# EAGLE design usb2ax_v2 (EAGLE 5.10)
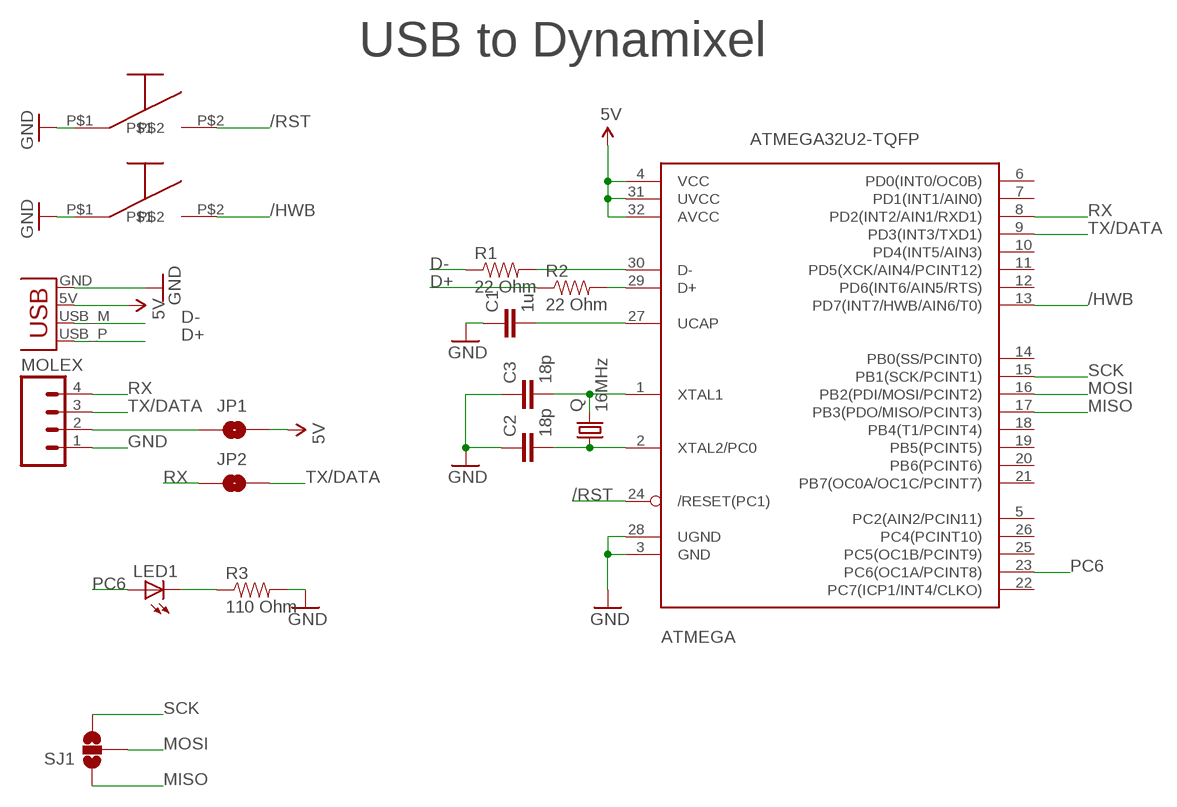
[diagram p0: schematic, sheet 1]

## Parts
ATMEGA  ATMEGA32U2-TQFP  [TQFP32-08]
C1  1u  CAP0603-CAP  [0603-CAP]
C2  18p  CAP0603-CAP  [0603-CAP]
C3  18p  CAP0603-CAP  [0603-CAP]
HWB  B3U-3000P  [B3U3000P]
JP1  SOLDERJUMPERNO  [SJ_2S-NO]
JP2  SOLDERJUMPERNO  [SJ_2S-NO]
LED1  LED0603  [LED-0603]
MOLEX  M041X04_NO_SILK  [1X04_NO_SILK]
Q  16MHz  CRYSTALHC49US  [HC49US]
R1  22 Ohm  RESISTOR0603-RES  [0603-RES]
R2  22 Ohm  RESISTOR0603-RES  [0603-RES]
R3  110 Ohm  RESISTOR0603-RES  [0603-RES]
RST  B3U-3000P  [B3U3000P]
SJ1  SOLDERJUMPER_2WAYS  [SJ_3]
X1  USBPCB  [USB-A-PCB]

## Nets
5V: ATMEGA.4(VCC) ATMEGA.31(UVCC) ATMEGA.32(AVCC) JP1.2 X1.5V(VBUS)
/HWB: ATMEGA.13(PD7(INT7/HWB/AIN6/T0)) HWB.P$2
/RST: ATMEGA.24(/RESET(PC1)) RST.P$2
D+: R2.1 X1.USB_P(D+)
D-: R1.1 X1.USB_M(D-)
GND: ATMEGA.3(GND) ATMEGA.28(UGND) C1.1 C2.1 C3.1 HWB.P$1 MOLEX.1 R3.2 RST.P$1 X1.GND
MISO: ATMEGA.17(PB3(PDO/MISO/PCINT3)) SJ1.1
MOSI: ATMEGA.16(PB2(PDI/MOSI/PCINT2)) SJ1.2
N$2: JP1.1 MOLEX.2
N$7: ATMEGA.2(XTAL2/PC0) C2.2 Q.1
N$8: ATMEGA.1(XTAL1) C3.2 Q.2
N$9: ATMEGA.29(D+) R2.2
N$10: ATMEGA.30(D-) R1.2
N$11: ATMEGA.27(UCAP) C1.2
N$12: LED1.C R3.1
PC6: ATMEGA.23(PC6(OC1A/PCINT8)) LED1.A
RX: ATMEGA.8(PD2(INT2/AIN1/RXD1)) JP2.1 MOLEX.4
SCK: ATMEGA.15(PB1(SCK/PCINT1)) SJ1.3
TX/DATA: ATMEGA.9(PD3(INT3/TXD1)) JP2.2 MOLEX.3
Unconnected: ATMEGA.5(PC2(AIN2/PCIN11)) ATMEGA.6(PD0(INT0/OC0B)) ATMEGA.7(PD1(INT1/AIN0)) ATMEGA.10(PD4(INT5/AIN3)) ATMEGA.11(PD5(XCK/AIN4/PCINT12)) ATMEGA.12(PD6(INT6/AIN5/RTS)) ATMEGA.14(PB0(SS/PCINT0)) ATMEGA.18(PB4(T1/PCINT4)) ATMEGA.19(PB5(PCINT5)) ATMEGA.20(PB6(PCINT6)) ATMEGA.21(PB7(OC0A/OC1C/PCINT7)) ATMEGA.22(PC7(ICP1/INT4/CLKO)) ATMEGA.25(PC5(OC1B/PCINT9)) ATMEGA.26(PC4(PCINT10))

## Notes on the sheet
- USB to Dynamixel

## Library data of the parts
ATMEGA = adafruit:ATMEGA32U2: ATmega32u2 Pin compatible with the atmega8u2, atmega16u2 and atmega32u2 8, 16 or 32 K flash, 1K RAM, 512b EEPROM 8 bit and 16 bit timer (5 PWM total) UART, SPI (no I2C!) USB with 4 endpoints, LUFA compatible 22 I/O lines, analog comparator (no ADC!) Comes with DFU bootloader burned in!
C1-C3 = SparkFun:CAP: Capacitor Standard 0603 ceramic capacitor, and 0.1" leaded capacitor.
HWB RST = omron-switch:B3U-3000P
JP1 JP2 = SparkFun:SOLDERJUMPER: Solder Jumper Standard SMD solder jumper. Used to automate production. Two varients : Normally Open and Normally Closed are the same, but have different paste layers. NC will have a large amount of paste and should jumper during reflow.
LED1 = SparkFun:LED: LEDs Standard schematic elements and footprints for 5mm, 3mm, 1206, and 0603 sized LEDs. 5mm - Spark Fun Electronics SKU : COM-00529 (and others)
MOLEX = SparkFun:M04: Header 4 Standard 4-pin 0.1" header. Use with straight break away headers (SKU : PRT-00116), right angle break away headers (PRT-00553), swiss pins (PRT-00743), machine pins (PRT-00117), and female headers (PRT-00115). Molex polarized connector foot print use with SKU : PRT-08231 with associated crimp pins and housings.
Q = SparkFun:CRYSTAL: Crystals Various standard crystals. Proven footprints. Spark Fun Electronics SKU : COM-00534
R1-R3 = SparkFun:RESISTOR: Resistor Basic schematic elements and footprints for 0603, 1206, and PTH 1/10th watt (small) resistors.
SJ1 = SparkFun:SOLDERJUMPER_2WAY: Solder Jumper 2 way solder jumper
X1 = SparkFun:USB: USB Connectors USB-B-PTH is fully proven SKU : PRT-00139 USB-miniB is fully proven SKU : PRT-00587 USB-A-PCB is untested. USB-A-H is throughly reviewed, but untested. Spark Fun Electronics SKU : PRT-00437 USB-B-SMT is throughly reviewed, but untested. Needs silkscreen touching up. USB-A-S has not been used/tested USB-MB-H has not been used/tested

## Board
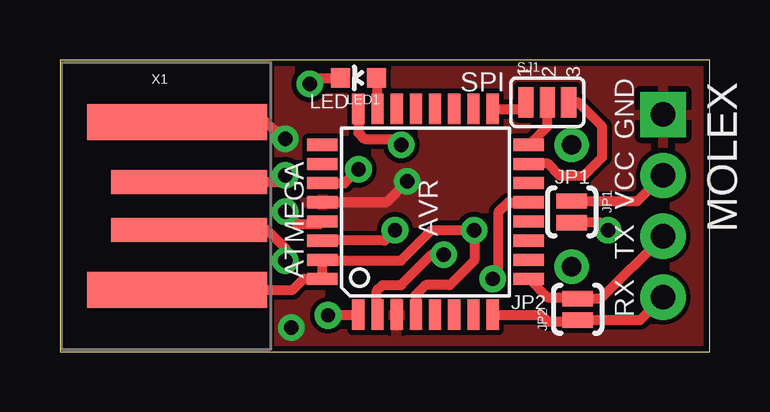
[diagram p1: board, top side]
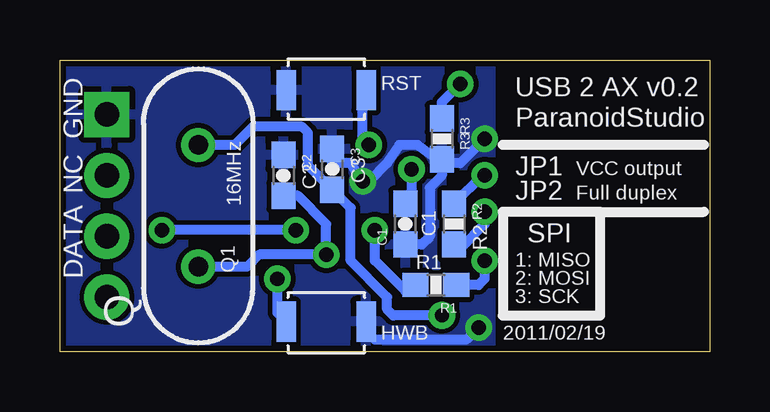
[diagram p2: board, bottom side, seen from below]

Size 27.1 x 12.18 mm. Coordinates in mm from the lower left corner, seen from the top.
Outline: 0,0 27.1,0 27.1,12.18 0,12.18 0,0
Copper layers (1*16): Top 0.035mm / dielectric 1.5mm / Bottom 0.035mm
Design rules "SparkFun": minimum track width 8mil, minimum drill 20mil, track to track 8mil, track to pad 8mil, pad to pad 8mil, via to via 8mil, smd to smd 8mil, copper to edge 10mil, drill to drill 8mil, minimum pad ring 12mil, minimum via ring 10mil, stop-mask expansion 4mil, vias tented up to drill 25mil, thermal gap 10mil

### Footprints (pad centres in the part's own frame; a part is rotated, then mirrored left to right if it is on the bottom)
TQFP32-08 = smd 1.27 x 0.508: 1 -4.293,2.8; 2 -4.293,2; 3 -4.293,1.2; 4 -4.293,0.4; 5 -4.293,-0.4; 6 -4.293,-1.2; 7 -4.293,-2; 8 -4.293,-2.8; 17 4.293,-2.8; 18 4.293,-2; 19 4.293,-1.2; 20 4.293,-0.4; 21 4.293,0.4; 22 4.293,1.2; 23 4.293,2; 24 4.293,2.8 | smd 0.508 x 1.27: 9 -2.8,-4.293; 10 -2,-4.293; 11 -1.2,-4.293; 12 -0.4,-4.293; 13 0.4,-4.293; 14 1.2,-4.293; 15 2,-4.293; 16 2.8,-4.293; 25 2.8,4.293; 26 2,4.293; 27 1.2,4.293; 28 0.4,4.293; 29 -0.4,4.293; 30 -1.2,4.293; 31 -2,4.293; 32 -2.8,4.293
0603-CAP = smd 1.1 x 1: 1 -0.85,0; 2 0.85,0
B3U3000P = smd 0.813 x 1.676: P$1 -1.67,0; P$2 1.67,0
SJ_2S-NO = smd 0.635 x 1.27: 1 -0.45,0; 2 0.45,0
LED-0603 = smd 0.8 x 0.8: A 0,-0.75; C 0,0.75
1X04_NO_SILK = drill 1.016 pad 1.88 square: 1 0,0 | drill 1.016 pad 1.88 round: 2 2.54,0; 3 5.08,0; 4 7.62,0
HC49US = drill 0.813 round: 1 -2.54,0; 2 2.54,0
0603-RES = smd 1.1 x 1: 1 -0.85,0; 2 0.85,0
SJ_3 = smd 0.635 x 1.27: 1 -0.889,0; 2 0,0; 3 0.889,0
USB-A-PCB = smd 7.5 x 1.5: 5V -0.2,-3.5; GND -0.2,3.5 | smd 6.5 x 1: USB_M 0.3,-1; USB_P 0.3,1

### Placement (x,y rotation side)
ATMEGA  15.24,5.84 90 top
C1  12.7,5.33 90 bottom
C2  17.78,7.37 270 bottom
C3  15.75,7.62 270 bottom
HWB  16,1.27 180 bottom
JP1  21.34,5.84 270 top
JP2  21.59,1.78 90 top
LED1  12.45,11.43 90 top
MOLEX  25.15,9.91 270 top
Q  21.34,6.1 90 bottom
R1  11.43,2.79 180 bottom
R2  10.67,5.33 270 bottom
R3  11.18,8.89 270 bottom
RST  16,10.92 0 bottom
SJ1  20.32,10.41 0 top
X1  5.08,6.1 0 top

### Tracks (layer width: path | path; a pad name or v marks a point on that pad's centre or on a via)
5V  (via drill 0.6)
  Top 0.406: X1.5V 9.71,2.6 10.16,3.05 ATMEGA.32 ATMEGA.31 10.98,3.81 14.22,3.81 15.49,5.08 v17.27,5.08 17.27,3.81 16.26,2.79 15.24,2.79 14.84,2.39 14.84,1.66 ATMEGA.4 | JP1.2 22.55,5.39 v22.86,5.08
  Bottom 0.406: v17.27,5.08 v22.86,5.08
/HWB  (via drill 0.6)
  Top 0.406: ATMEGA.13 18.69,6.24 18.29,5.84 18.29,3.3 v18.03,3.05
  Bottom 0.406: v18.03,3.05 18.03,1.63 HWB.P$2
/RST  (via drill 0.6)
  Top 0.406: ATMEGA.24 12.44,9.15 12.7,8.89 14.22,8.89 v14.22,8.64
  Bottom 0.406: v14.22,8.64 14.48,8.89 14.48,10.56 RST.P$2
D+  (via drill 0.6)
  Top 0.406: X1.USB_P 9.13,7.1 v9.4,7.37
  Bottom 0.406: v9.4,7.37 9.49,7.37 R2.1
D-  (via drill 0.6)
  Top 0.406: X1.USB_M 5.4,5.08 8.64,5.08 9.4,4.32 v9.4,3.81
  Bottom 0.406: R1.1 9.65,2.79 9.4,3.05 v9.4,3.81
GND  (via drill 0.6)
  Top 0.406: X1.GND 8.58,9.6 v9.4,8.89 | ATMEGA.28 13.61,6.24 v14.48,7.11
  Bottom 0.406: v9.4,8.89 10.41,7.87 11.09,7.87 R3.2 | R3.2 11.18,7.87 12.19,8.64 12.95,8.64 13.46,7.87 14.22,7.11 v14.48,7.11 14.99,7.87 15.75,7.87 C3.1 | C1.1 12.03,4.48 11.68,4.83 11.68,6.86 11.18,7.37 R3.2 | HWB.P$1 14.33,0.87 13.97,0.51 10.16,0.51 v9.65,1.02
  pour Bottom: 9.14,0 28.96,0 28.96,12.19 9.14,12.19
  pour Top: 9.14,0 29.72,0 29.72,12.19 9.14,12.19
MISO
  Top 0.406: ATMEGA.17 19.15,10.13 SJ1.1
MOSI
  Top 0.406: ATMEGA.16 19.56,8.64 20.32,9.4 SJ1.2
N$2
  Top 0.406: JP1.1 24.07,6.29 MOLEX.2
N$7  (via drill 0.6)
  Top 0.406: v16,4.06 15.49,4.06 14.22,2.79 13.46,2.79 13.21,2.54 13.21,1.58 ATMEGA.2
  Bottom 0.406: Q.1 19.3,3.56 18.8,4.06 v16,4.06 16,5.33 17.18,6.52 C2.2
N$8  (via drill 0.6)
  Top 0.406: v11.18,1.52 12.45,1.52 12.46,1.29 12.46,1.27 ATMEGA.1
  Bottom 0.406: v11.18,1.52 13.21,1.52 13.46,1.78 13.46,2.29 14.99,3.81 14.99,6.01 C3.2 16.76,7.79 16.76,9.14 17.02,9.4 19.05,9.4 19.81,8.64 Q.2
N$9  (via drill 0.6)
  Top 0.406: v9.4,5.84 9.91,5.33 10.84,5.33 ATMEGA.29
  Bottom 0.406: R2.2 10.33,4.41 9.4,5.33 v9.4,5.84
N$10  (via drill 0.6)
  Top 0.406: ATMEGA.30 13.53,4.64 v13.97,5.08
  Bottom 0.406: R1.2 12.7,2.54 13.97,3.81 v13.97,5.08
N$11  (via drill 0.6)
  Top 0.406: ATMEGA.27 11.87,7.04 v12.45,7.62
  Bottom 0.406: v12.45,7.62 12.45,6.35 12.87,6.35 C1.2
N$12  (via drill 0.6)
  Top 0.406: v10.41,11.18 10.67,11.43 LED1.C
  Bottom 0.406: R3.1 11.18,10.41 v10.41,11.18
PC6
  Top 0.406: ATMEGA.23 13.24,11.39 LED1.A
RX
  Top 0.406: ATMEGA.8 20.04,1.55 20.32,1.27 21.28,1.27 JP2.1 24.19,1.33 MOLEX.4
SCK
  Top 0.406: SJ1.3 21.59,10.41 22.61,9.4 22.61,8.13 21.84,7.37 20.83,7.37 20.32,7.87 19.57,7.87 ATMEGA.15
TX/DATA
  Top 0.406: ATMEGA.9 19.56,3.04 20.32,2.29 21.28,2.29 JP2.2 22.55,2.23 MOLEX.3

### Text on the board
tPlace: SPI | 1 | 2 | 3 | GND | LED | JP1 | VCC | AVR | TX | RX | JP2
bPlace: USB 2 AX v0.2 | RST | ParanoidStudio | R3 | GND | C3 | C2 | VCC output | JP1 | NC | Full duplex | JP2 | 16MHz | SPI | R2 | C1 | 1: MISO | R1 | 2: MOSI | Q1 | DATA | 3: SCK | 2011/02/19 | HWB